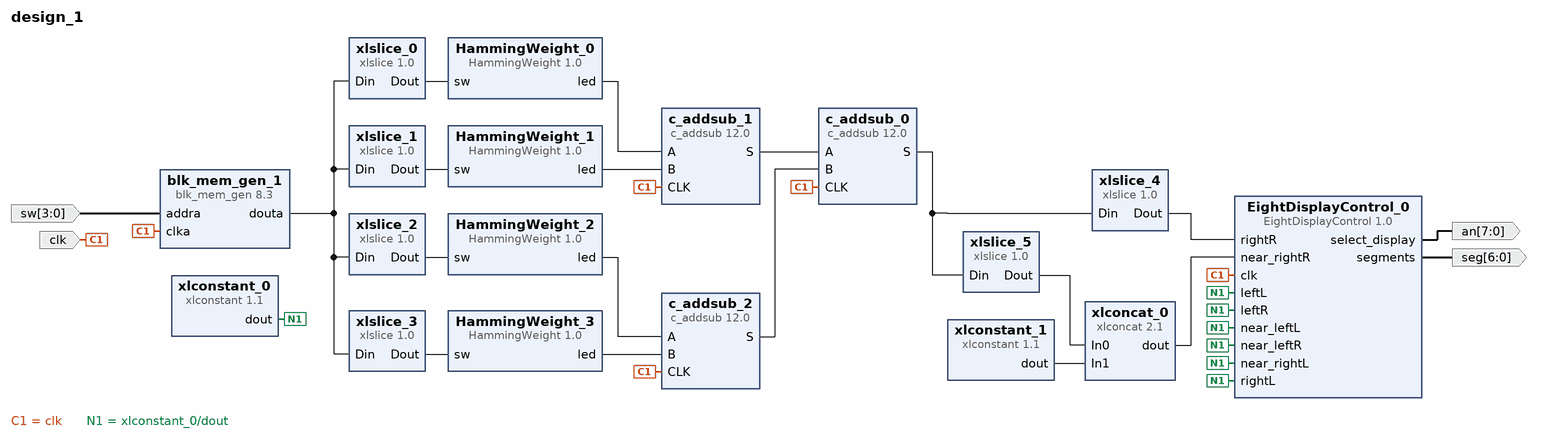
[diagram p0: block diagram of the top level]
# Vivado block design design_1, Vivado 2015.4
create_bd_design design_1

create_bd_port -dir I -from 3 -to 0 sw
create_bd_port -dir I clk
create_bd_port -dir O -from 6 -to 0 seg
create_bd_port -dir O -from 7 -to 0 an

create_bd_cell -type ip -vlnv xilinx.com:ip:blk_mem_gen:8.3 blk_mem_gen_1
set_property -dict [list \
  CONFIG.Memory_Type Single_Port_ROM \
  CONFIG.Enable_32bit_Address false \
  CONFIG.Write_Width_A 64 \
  CONFIG.Write_Depth_A 16 \
  CONFIG.Enable_A Always_Enabled \
  CONFIG.Register_PortA_Output_of_Memory_Primitives false \
  CONFIG.Load_Init_File true \
  CONFIG.Coe_File ../../../../../../coe_file.coe \
  CONFIG.Use_RSTA_Pin false \
  CONFIG.Port_A_Write_Rate 0 \
  CONFIG.use_bram_block Stand_Alone \
] [get_bd_cells blk_mem_gen_1]
create_bd_cell -type ip -vlnv xilinx.com:ip:xlslice:1.0 xlslice_0
set_property -dict {CONFIG.DOUT_WIDTH 16 CONFIG.DIN_TO 48 CONFIG.DIN_FROM 63 CONFIG.DIN_WIDTH 64} [get_bd_cells xlslice_0]
create_bd_cell -type ip -vlnv xilinx.com:ip:xlslice:1.0 xlslice_1
set_property -dict {CONFIG.DOUT_WIDTH 16 CONFIG.DIN_TO 32 CONFIG.DIN_FROM 47 CONFIG.DIN_WIDTH 64} [get_bd_cells xlslice_1]
create_bd_cell -type ip -vlnv xilinx.com:ip:xlslice:1.0 xlslice_2
set_property -dict {CONFIG.DOUT_WIDTH 16 CONFIG.DIN_TO 16 CONFIG.DIN_FROM 31 CONFIG.DIN_WIDTH 64} [get_bd_cells xlslice_2]
create_bd_cell -type ip -vlnv xilinx.com:ip:xlslice:1.0 xlslice_3
set_property -dict {CONFIG.DOUT_WIDTH 16 CONFIG.DIN_TO 0 CONFIG.DIN_FROM 15 CONFIG.DIN_WIDTH 64} [get_bd_cells xlslice_3]
create_bd_cell -type ip -vlnv xilinx.com:ip:c_addsub:12.0 c_addsub_0
set_property -dict [list \
  CONFIG.A_Width 6 \
  CONFIG.B_Width 6 \
  CONFIG.Out_Width 7 \
  CONFIG.Latency 1 \
  CONFIG.B_Value 000000 \
  CONFIG.CE false \
] [get_bd_cells c_addsub_0]
create_bd_cell -type ip -vlnv xilinx.com:ip:c_addsub:12.0 c_addsub_1
set_property -dict [list \
  CONFIG.A_Width 5 \
  CONFIG.B_Width 5 \
  CONFIG.Out_Width 6 \
  CONFIG.Latency 1 \
  CONFIG.B_Value 00000 \
  CONFIG.CE false \
] [get_bd_cells c_addsub_1]
create_bd_cell -type ip -vlnv xilinx.com:ip:c_addsub:12.0 c_addsub_2
set_property -dict [list \
  CONFIG.A_Width 5 \
  CONFIG.B_Width 5 \
  CONFIG.Out_Width 6 \
  CONFIG.Latency 1 \
  CONFIG.B_Value 00000 \
  CONFIG.CE false \
] [get_bd_cells c_addsub_2]
create_bd_cell -type ip -vlnv ua.pt:user:EightDisplayControl:1.0 EightDisplayControl_0
create_bd_cell -type ip -vlnv xilinx.com:ip:xlslice:1.0 xlslice_4
set_property -dict {CONFIG.DOUT_WIDTH 4 CONFIG.DIN_TO 0 CONFIG.DIN_FROM 3 CONFIG.DIN_WIDTH 7} [get_bd_cells xlslice_4]
create_bd_cell -type ip -vlnv xilinx.com:ip:xlslice:1.0 xlslice_5
set_property -dict {CONFIG.DOUT_WIDTH 3 CONFIG.DIN_TO 4 CONFIG.DIN_FROM 6 CONFIG.DIN_WIDTH 7} [get_bd_cells xlslice_5]
create_bd_cell -type ip -vlnv xilinx.com:ip:xlconstant:1.1 xlconstant_0
set_property -dict {CONFIG.CONST_WIDTH 4 CONFIG.CONST_VAL 0} [get_bd_cells xlconstant_0]
create_bd_cell -type ip -vlnv ua.pt:user:HammingWeight:1.0 HammingWeight_0
create_bd_cell -type ip -vlnv ua.pt:user:HammingWeight:1.0 HammingWeight_1
create_bd_cell -type ip -vlnv ua.pt:user:HammingWeight:1.0 HammingWeight_2
create_bd_cell -type ip -vlnv ua.pt:user:HammingWeight:1.0 HammingWeight_3
create_bd_cell -type ip -vlnv xilinx.com:ip:xlconcat:2.1 xlconcat_0
set_property -dict {CONFIG.IN0_WIDTH 3 CONFIG.IN1_WIDTH 1} [get_bd_cells xlconcat_0]
create_bd_cell -type ip -vlnv xilinx.com:ip:xlconstant:1.1 xlconstant_1
set_property -dict {CONFIG.CONST_VAL 0} [get_bd_cells xlconstant_1]

# ---- connections ----

connect_bd_net [get_bd_ports sw] [get_bd_pins blk_mem_gen_1/addra]
connect_bd_net [get_bd_ports clk] \
  [get_bd_pins blk_mem_gen_1/clka] [get_bd_pins c_addsub_1/CLK] [get_bd_pins c_addsub_2/CLK] [get_bd_pins c_addsub_0/CLK] \
  [get_bd_pins EightDisplayControl_0/clk]
connect_bd_net [get_bd_pins blk_mem_gen_1/douta] \
  [get_bd_pins xlslice_0/Din] [get_bd_pins xlslice_1/Din] [get_bd_pins xlslice_2/Din] [get_bd_pins xlslice_3/Din]
connect_bd_net [get_bd_pins xlslice_0/Dout] [get_bd_pins HammingWeight_0/sw]
connect_bd_net [get_bd_pins xlslice_1/Dout] [get_bd_pins HammingWeight_1/sw]
connect_bd_net [get_bd_pins xlslice_2/Dout] [get_bd_pins HammingWeight_2/sw]
connect_bd_net [get_bd_pins xlslice_3/Dout] [get_bd_pins HammingWeight_3/sw]
connect_bd_net [get_bd_pins c_addsub_1/S] [get_bd_pins c_addsub_0/A]
connect_bd_net [get_bd_pins c_addsub_2/S] [get_bd_pins c_addsub_0/B]
connect_bd_net [get_bd_pins c_addsub_0/S] [get_bd_pins xlslice_4/Din] [get_bd_pins xlslice_5/Din]
connect_bd_net [get_bd_pins EightDisplayControl_0/segments] [get_bd_ports seg]
connect_bd_net [get_bd_pins EightDisplayControl_0/select_display] [get_bd_ports an]
connect_bd_net [get_bd_pins xlslice_4/Dout] [get_bd_pins EightDisplayControl_0/rightR]
connect_bd_net [get_bd_pins xlconstant_0/dout] \
  [get_bd_pins EightDisplayControl_0/leftR] [get_bd_pins EightDisplayControl_0/near_leftR] \
  [get_bd_pins EightDisplayControl_0/rightL] [get_bd_pins EightDisplayControl_0/near_rightL] \
  [get_bd_pins EightDisplayControl_0/near_leftL] [get_bd_pins EightDisplayControl_0/leftL]
connect_bd_net [get_bd_pins HammingWeight_0/led] [get_bd_pins c_addsub_1/A]
connect_bd_net [get_bd_pins HammingWeight_3/led] [get_bd_pins c_addsub_2/B]
connect_bd_net [get_bd_pins HammingWeight_2/led] [get_bd_pins c_addsub_2/A]
connect_bd_net [get_bd_pins HammingWeight_1/led] [get_bd_pins c_addsub_1/B]
connect_bd_net [get_bd_pins xlslice_5/Dout] [get_bd_pins xlconcat_0/In0]
connect_bd_net [get_bd_pins xlconstant_1/dout] [get_bd_pins xlconcat_0/In1]
connect_bd_net [get_bd_pins xlconcat_0/dout] [get_bd_pins EightDisplayControl_0/near_rightR]

validate_bd_design
save_bd_design
